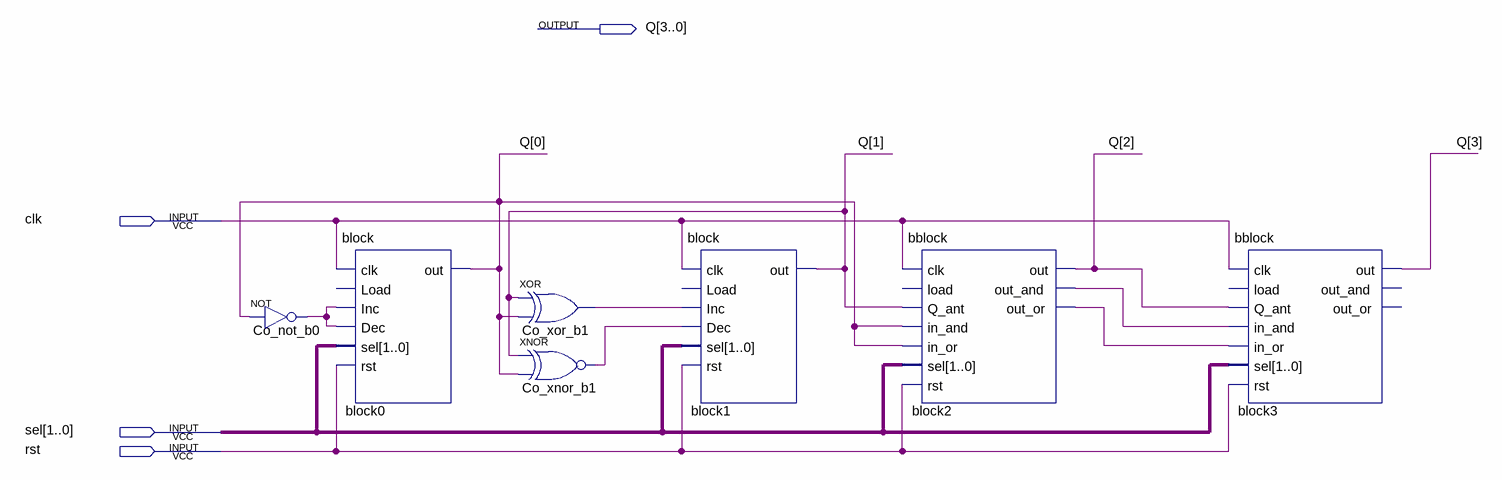
[diagram p0: schematic sheet]
// Quartus schematic test_bblock.bdf as structural Verilog: 7 symbols, 4 pins
module test_bblock (
  input  clk,
  input  [1:0] sel,
  input  rst,
  output [3:0] Q
);

  wire block2_out_and, block2_out_or, Co_not_b0_out, Co_xnor_b1_out, Co_xor_b1_out;

  not Co_not_b0 (Co_not_b0_out, Q[0]);
  block block0 (.clk(clk), .Inc(Co_not_b0_out), .Dec(Co_not_b0_out), .sel(sel), .rst(rst), .out(Q[0]));  // open: Load
  xor Co_xor_b1 (Co_xor_b1_out, Q[1], Q[0]);
  xnor Co_xnor_b1 (Co_xnor_b1_out, Q[1], Q[0]);
  block block1 (.clk(clk), .Inc(Co_xor_b1_out), .Dec(Co_xnor_b1_out), .sel(sel), .rst(rst), .out(Q[1]));  // open: Load
  bblock block2 (
    .clk(clk), .Q_ant(Q[1]), .in_and(Q[0]), .in_or(Q[0]), .sel(sel), .rst(rst), .out(Q[2]),
    .out_and(block2_out_and), .out_or(block2_out_or));  // open: load
  bblock block3 (
    .clk(clk), .Q_ant(Q[2]), .in_and(block2_out_and), .in_or(block2_out_or), .sel(sel), .rst(rst), .out(Q[3]));  // open: load, out_and, out_or
endmodule
